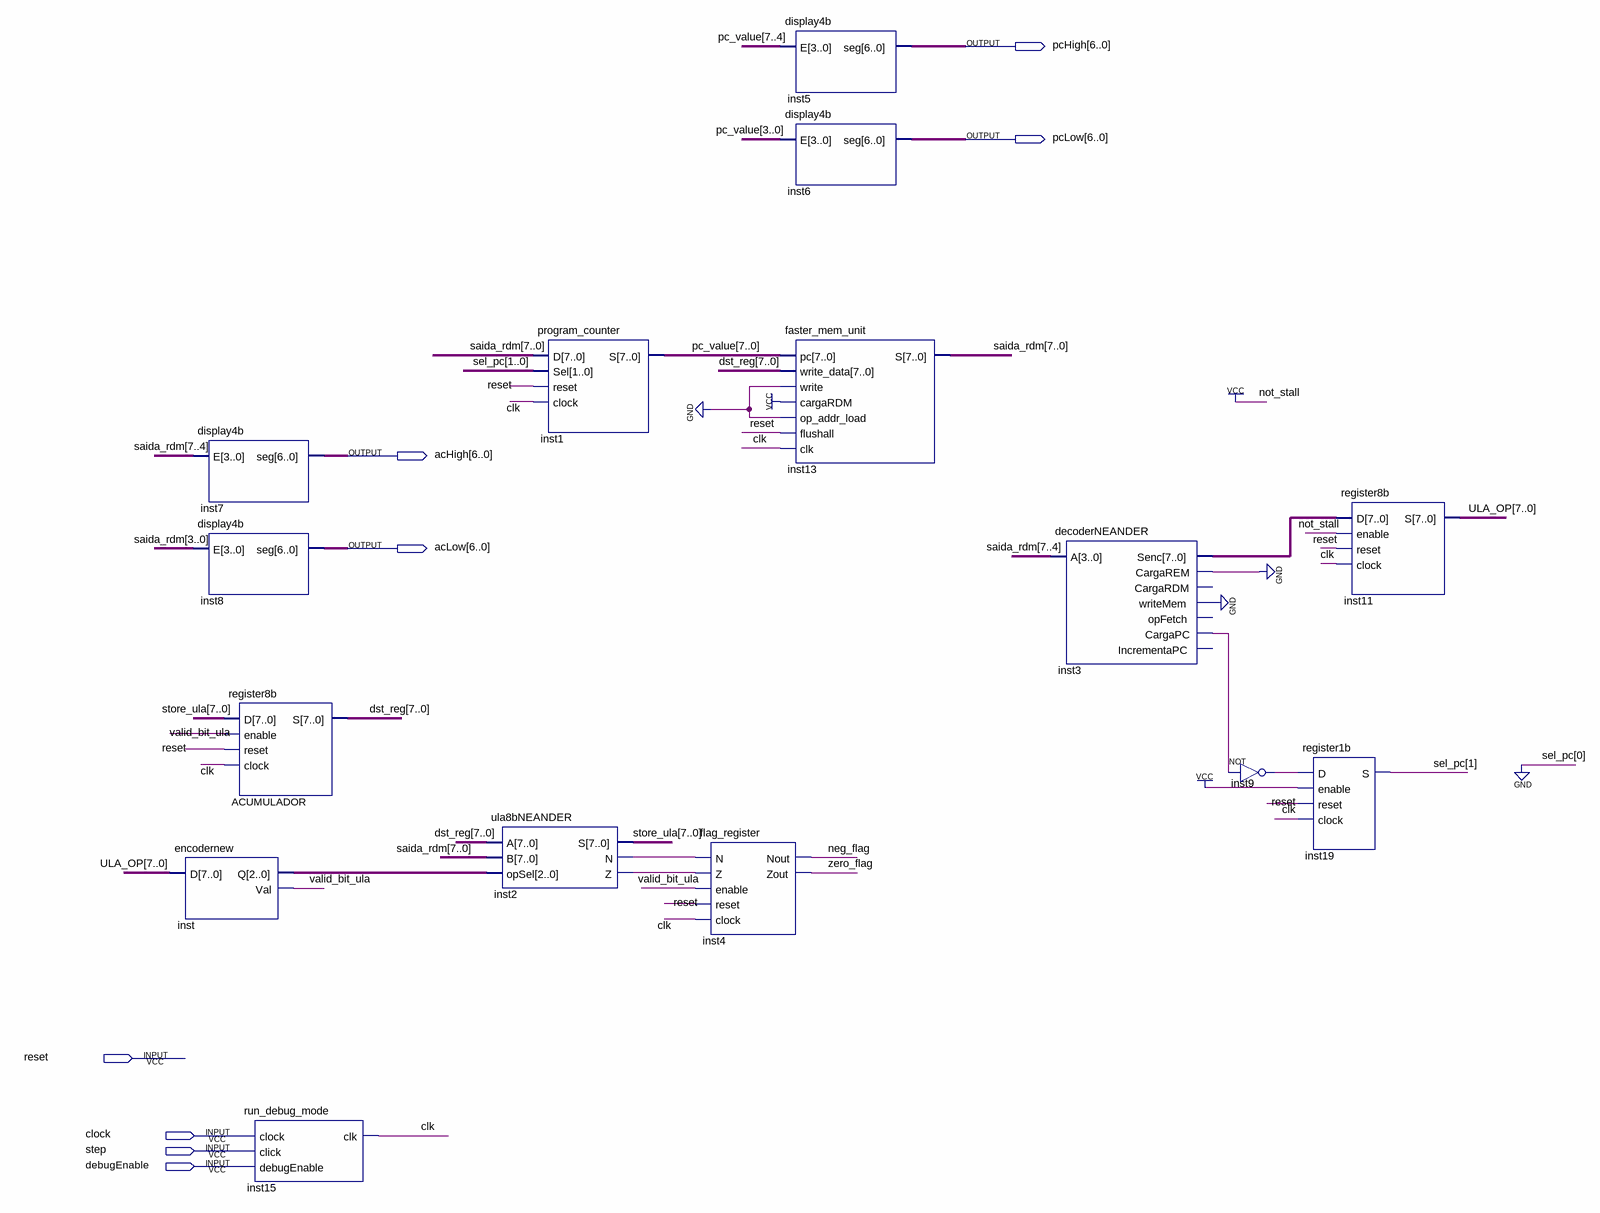
[diagram p0: schematic sheet]
// Quartus schematic neander.bdf as structural Verilog: 15 symbols, 8 pins
module neander (
  input  reset,
  input  clock,
  input  step,
  input  debugEnable,
  output [6:0] pcHigh,
  output [6:0] pcLow,
  output [6:0] acHigh,
  output [6:0] acLow
);

  wire clk, inst2_n, inst2_z, inst3_cargapc, inst3_cargarem, inst3_writemem, inst9_out, neg_flag,
       valid_bit_ula, zero_flag;
  wire [1:1] sel_pc;
  wire [2:0] inst_q;
  wire [7:0] dst_reg, inst3_senc, pc_value, saida_rdm, store_ula, ULA_OP;

  encodernew inst (.D(ULA_OP), .Q(inst_q), .Val(valid_bit_ula));
  display4b inst7 (.E(saida_rdm[7:4]), .seg(acHigh));
  display4b inst8 (.E(saida_rdm[3:0]), .seg(acLow));
  register8b ACUMULADOR (.D(store_ula), .enable(valid_bit_ula), .reset(reset), .clock(clk), .S(dst_reg));
  run_debug_mode inst15 (.clk(clk));  // open: clock, click, debugEnable
  program_counter inst1 (.D(saida_rdm), .Sel({sel_pc[1], 1'b0}), .reset(reset), .clock(clk), .S(pc_value));
  ula8bNEANDER inst2 (.A(dst_reg), .B(saida_rdm), .opSel(inst_q), .S(store_ula), .N(inst2_n), .Z(inst2_z));
  flag_register inst4 (
    .N(inst2_n), .Z(inst2_z), .enable(valid_bit_ula), .reset(reset), .clock(clk), .Nout(neg_flag),
    .Zout(zero_flag));
  display4b inst5 (.E(pc_value[7:4]), .seg(pcHigh));
  display4b inst6 (.E(pc_value[3:0]), .seg(pcLow));
  faster_mem_unit inst13 (
    .pc(pc_value), .write_data(dst_reg), .write(1'b0), .cargaRDM(1'b1), .op_addr_load(1'b0),
    .flushall(reset), .clk(clk), .S(saida_rdm));
  decoderNEANDER inst3 (
    .A(saida_rdm[7:4]), .Senc(inst3_senc), .CargaREM(inst3_cargarem), .writeMem(inst3_writemem),
    .CargaPC(inst3_cargapc));  // open: CargaRDM, opFetch, IncrementaPC
  not inst9 (inst9_out, inst3_cargapc);
  register8b inst11 (.D(inst3_senc), .enable(1'b1), .reset(reset), .clock(clk), .S(ULA_OP));
  register1b inst19 (.D(inst9_out), .enable(1'b1), .reset(reset), .clock(clk), .S(sel_pc[1]));
  // also tied to GND on the sheet: {inst3_cargarem, inst3_writemem}
endmodule
